# Altium schematic sheet Voltage Regulator.SchDoc
size A4; SheetNumber: 8; SheetTotal: 8
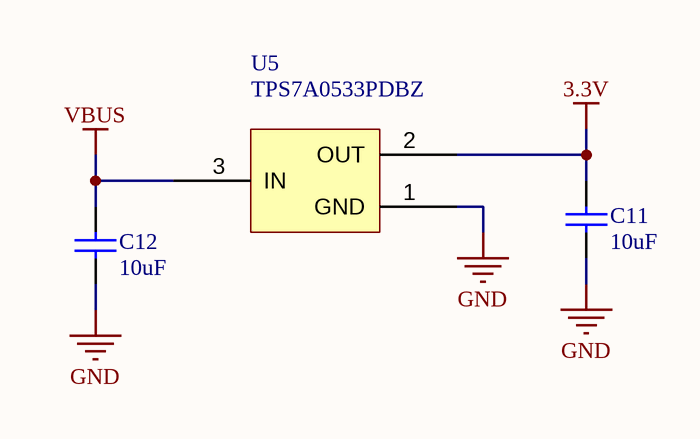
[diagram p0: Voltage Regulator.SchDoc]

## Parts
C11  10uF  [Capacitor 0603]
C12  10uF  [Capacitor 0603]
U5  TPS7A0533PDBZ  [SOT-23]

## Nets
3.3V: C11.2 U5.2(OUT)
GND: C11.1 C12.1 U5.1(GND)
VBUS: C12.2 U5.3(IN)

## Notes on the sheet
- TITLE
- SIZE
- A4
- VARIANT
- PROJECT
- SHEET
- VERSION
- OF
- AUTHOR
- DATE

## Library data of the parts
C11 C12 = Capacitor